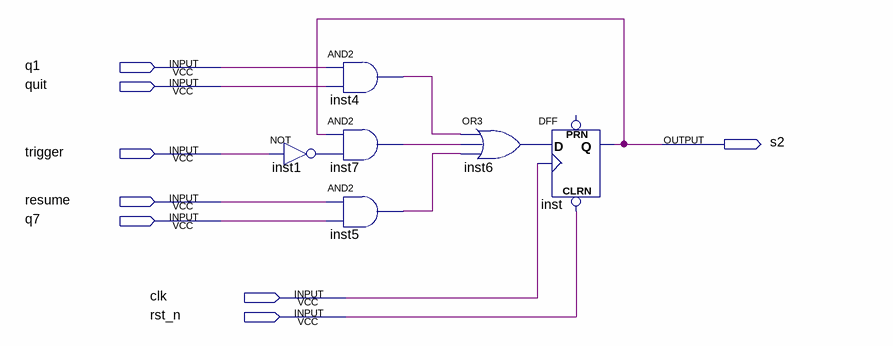
[diagram p0: schematic sheet]
// Quartus schematic s2.bdf as structural Verilog: 6 symbols, 8 pins
module s2 (
  input  q1,
  input  quit,
  input  trigger,
  input  resume,
  input  q7,
  input  clk,
  input  rst_n,
  output s2
);

  wire inst1_out, inst4_out, inst5_out, inst6_out, inst7_out;

  not inst1 (inst1_out, trigger);
  and inst4 (inst4_out, q1, quit);
  and inst7 (inst7_out, s2, inst1_out);
  and inst5 (inst5_out, resume, q7);
  or inst6 (inst6_out, inst4_out, inst7_out, inst5_out);
  DFF inst (.CLRN(rst_n), .CLK(clk), .D(inst6_out), .Q(s2));  // open: PRN
endmodule
